# EAGLE schematic Adafruit PowerBoost 1000C Rev B (EAGLE 9.2.2)
COMPANY: ADAFRUIT INDUSTRIES; DRAWN: KTOWN; REV: A
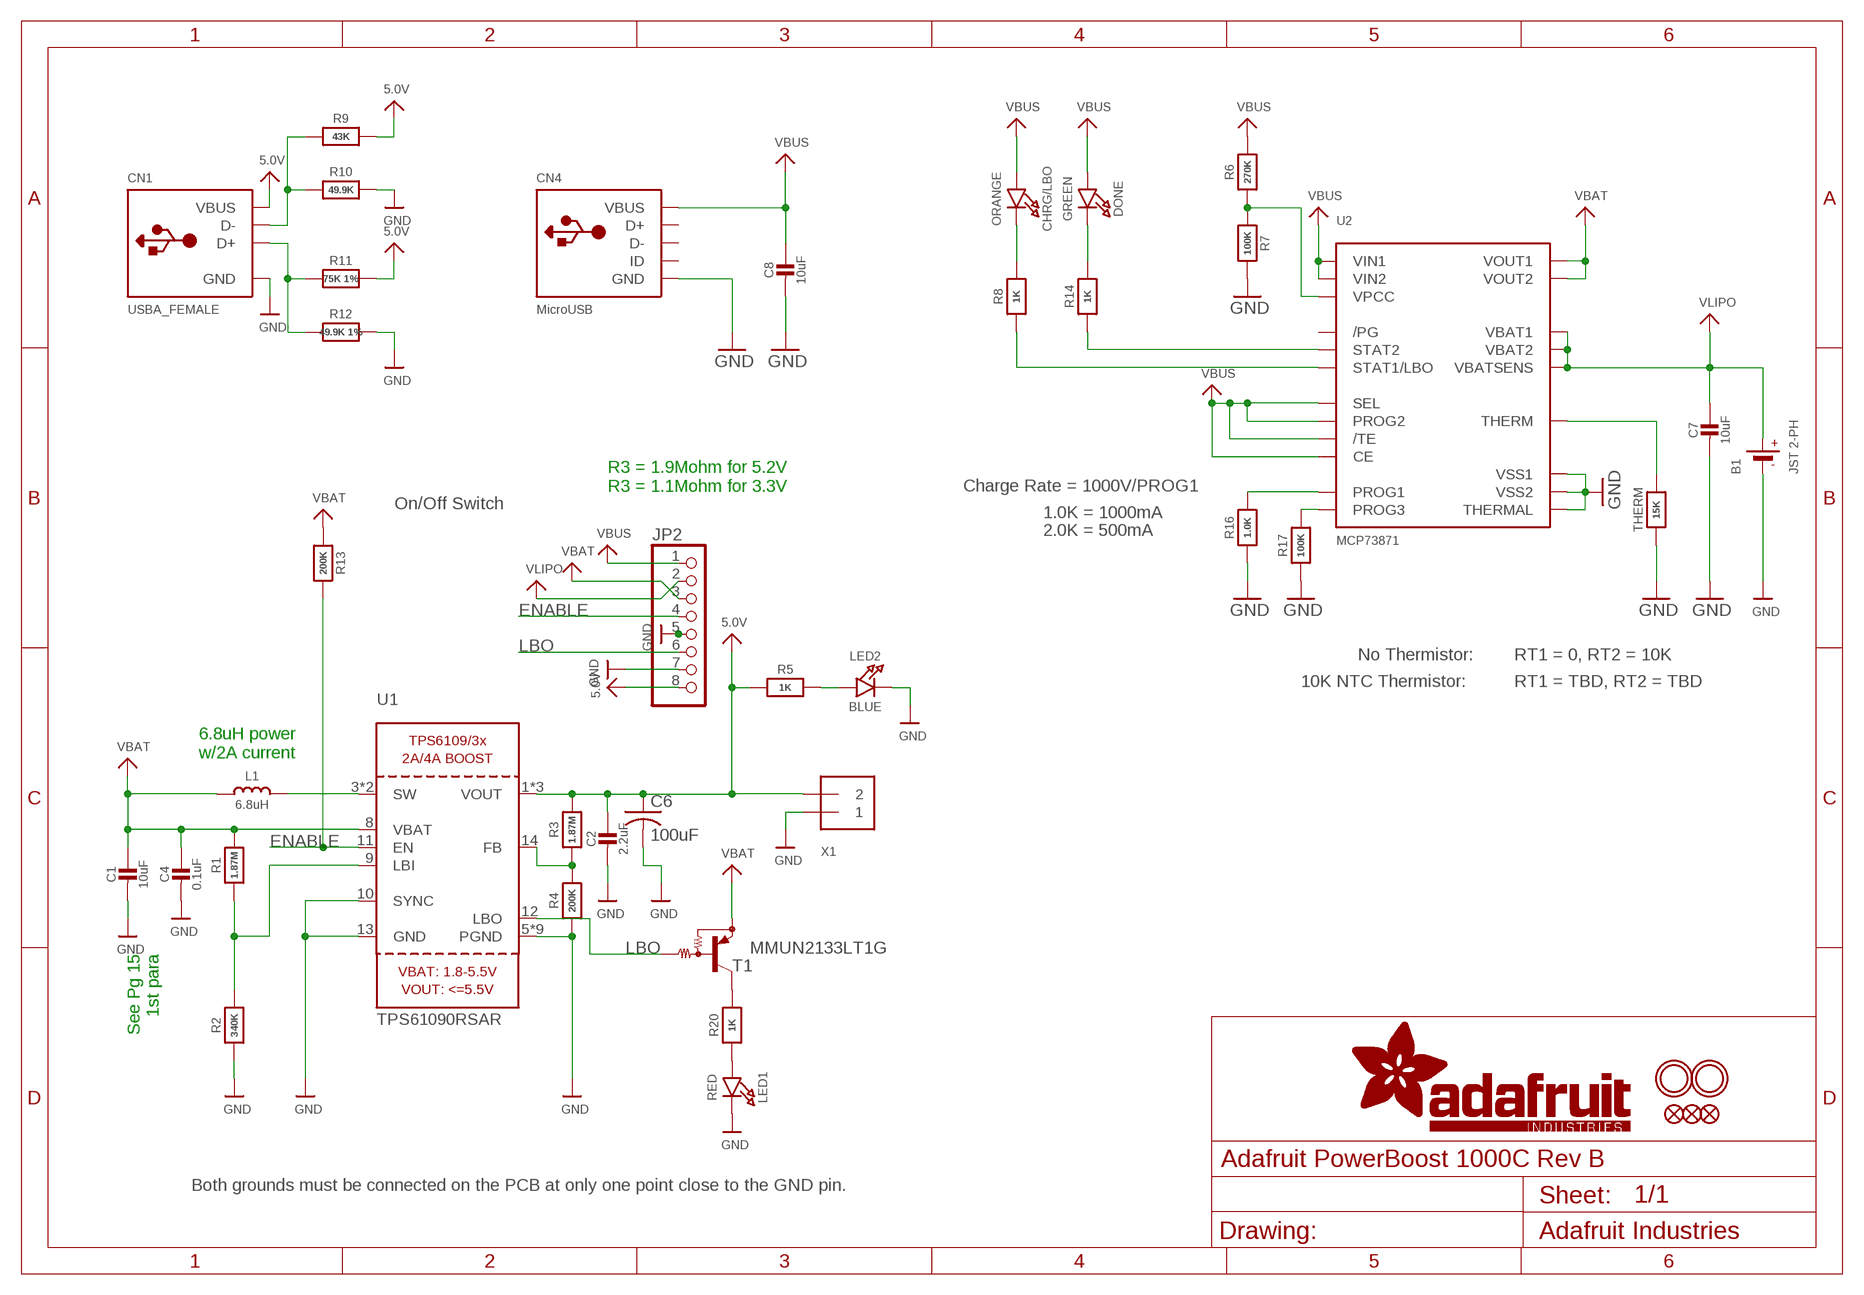
[diagram p0: schematic, sheet 1]

## Parts
B1  JST 2-PH  BATTERY  [JSTPH2]
C1  10uF  CAP_CERAMIC0805-NOOUTLINE  [0805-NO]
C2  2.2uF  CAP_CERAMIC0805-NOOUTLINE  [0805-NO]
C4  0.1uF  CAP_CERAMIC0805_10MGAP  [0805_10MGAP]
C6  100uF  C-USC1210  [C1210]
C7  10uF  CAP_CERAMIC0805-NOOUTLINE  [0805-NO]
C8  10uF  CAP_CERAMIC0805-NOOUTLINE  [0805-NO]
CHRG/LBO  ORANGE  LED0805_NOOUTLINE  [CHIPLED_0805_NOOUTLINE]
CN1  USBA_FEMALE  USB_TYPEAPTHFML  [USB_HOST-PTH]
CN4  MicroUSB  USBMICRO_20329  [4UCONN_20329]
DONE  GREEN  LED0805_NOOUTLINE  [CHIPLED_0805_NOOUTLINE]
FID1  FIDUCIAL""  [FIDUCIAL_1MM]
FID2  FIDUCIAL""  [FIDUCIAL_1MM]
FID3  FIDUCIAL""  [FIDUCIAL_1MM]
JP2  HEADER-1X8ROUND  [1X08_ROUND]
L1  6.8uH  INDUCTORTDK_VLC5045  [INDUCTOR_5X5MM_TDK_VLC5045]
LED1  RED  LED0805_NOOUTLINE  [CHIPLED_0805_NOOUTLINE]
LED2  BLUE  LED0805_NOOUTLINE  [CHIPLED_0805_NOOUTLINE]
R1  1.87M  RESISTOR_0805MP  [_0805MP]
R2  340K  RESISTOR_0805MP  [_0805MP]
R3  1.87M  RESISTOR0805_NOOUTLINE  [0805-NO]
R4  200K  RESISTOR0805_NOOUTLINE  [0805-NO]
R5  1K  RESISTOR0805_NOOUTLINE  [0805-NO]
R6  270K  RESISTOR0805_NOOUTLINE  [0805-NO]
R7  100K  RESISTOR0805_NOOUTLINE  [0805-NO]
R8  1K  RESISTOR0805_NOOUTLINE  [0805-NO]
R9  43K  RESISTOR0805_NOOUTLINE  [0805-NO]
R10  49.9K  RESISTOR0805_NOOUTLINE  [0805-NO]
R11  75K 1%  RESISTOR0805_NOOUTLINE  [0805-NO]
R12  49.9K 1%  RESISTOR0805_NOOUTLINE  [0805-NO]
R13  200K  RESISTOR0805_NOOUTLINE  [0805-NO]
R14  1K  RESISTOR0805_NOOUTLINE  [0805-NO]
R16  1.0K  RESISTOR0805_NOOUTLINE  [0805-NO]
R17  100K  RESISTOR0805_NOOUTLINE  [0805-NO]
R20  1K  RESISTOR0805_NOOUTLINE  [0805-NO]
T1  MMUN2133LT1G  MUN2114T1-PNP_DRIVER-SC59-BEC  [SC59-BEC]
THERM  15K  RESISTOR0805_NOOUTLINE  [0805-NO]
U1  TPS61090RSAR  VREG_TPS6103X  [PVQFN-16]
U2  MCP73871  [QFN20_4MM]
U$10  MOUNTINGHOLE2.5  [MOUNTINGHOLE_2.5_PLATED]
U$11  MOUNTINGHOLE2.5  [MOUNTINGHOLE_2.5_PLATED]
X1  TERMBLOCK_1X2  [TERMBLOCK_1X2-3.5MM]

## Nets
5.0V: C2.1 C6.1 CN1.VBUS JP2.8 R3.2 R5.1 R9.2 R11.2 U1.1(VOUT) U1.15(VOUT) U1.16(VOUT) X1.2
D+: CN1.D+ R11.1 R12.1
D-: CN1.D- R9.1 R10.1
ENABLE: JP2.4 R13.2 U1.11(EN)
GND: B1.1(-) C1.2 C2.2 C4.2 C6.2 C7.2 C8.2 CN1.GND CN4.BASE@1(GND) CN4.BASE@2(GND) CN4.GND CN4.SPRT@1(GND) CN4.SPRT@2(GND) CN4.SPRT@3(GND) CN4.SPRT@4(GND) JP2.5 JP2.7 LED1.C LED2.C R2.1 R4.1 R7.2 R10.2 R12.2 R16.1 R17.1 THERM.1 U1.5(PGND) U1.6(PGND) U1.7(PGND) U1.10(SYNC) U1.13(GND) U1.P$18(PGND) U1.P$19(PGND) U1.P$20(PGND) U1.P$21(PGND) U1.P$22(PGND) U1.THERMAL(PGND) U2.P$10(VSS1) U2.P$11(VSS2) U2.P$21(THERMAL) X1.1
LBO: JP2.6 T1.B U1.12(LBO)
N$1: L1.P$2 U1.3(SW) U1.4(SW)
N$2: LED1.A R20.1
N$3: R1.1 R2.2 U1.9(LBI)
N$4: LED2.A R5.2
N$5: R3.1 R4.2 U1.14(FB)
N$6: R20.2 T1.C
N$7: R6.1 R7.1 U2.P$2(VPCC)
N$8: DONE.C R14.2
N$9: R14.1 U2.P$7(STAT2)
N$10: THERM.2 U2.P$5(THERM)
N$11: R8.1 U2.P$8(STAT1/LBO)
N$12: CHRG/LBO.C R8.2
N$13: R17.2 U2.P$12(PROG3)
N$16: R16.2 U2.P$13(PROG1)
VBAT: C1.1 C4.1 JP2.3 L1.P$1 R1.2 R13.1 T1.E U1.8(VBAT) U2.P$1(VOUT1) U2.P$20(VOUT2)
VBUS: C8.1 CHRG/LBO.A CN4.VBUS DONE.A JP2.1 R6.2 U2.P$3(SEL) U2.P$4(PROG2) U2.P$9(/TE) U2.P$17(CE) U2.P$18(VIN1) U2.P$19(VIN2)
VLIPO: B1.2(+) C7.1 JP2.2 U2.P$14(VBAT1) U2.P$15(VBAT2) U2.P$16(VBATSENS)
Unconnected: CN4.D+ CN4.D- CN4.ID U2.P$6(/PG)

## Notes on the sheet
- R3 = 1.9Mohm for 5.2V
  R3 = 1.1Mohm for 3.3V
- Charge Rate = 1000V/PROG1
- On/Off Switch
- 1.0K = 1000mA
- 2.0K = 500mA
- No Thermistor: | RT1 = 0, RT2 = 10K
- 10K NTC Thermistor: | RT1 = TBD, RT2 = TBD
- 6.8uH power
  w/2A current
- See Pg 15
  1st para
- Both grounds must be connected on the PCB at only one point close to the GND pin.

## Library data of the parts
B1 = microbuilder:BATTERY: CR1220 SMT - Digikey: 3001K-ND CD2032 BAT-HLD-001 - Digikey: BAT-HLD-001-ND
C1 C2 C4 C7 C8 = microbuilder:CAP_CERAMIC: Ceramic Capacitors For new designs, use the packages preceded by an '_' character since they are more reliable: The following footprints should be used on most boards: _0402 - Standard footprint for regular board layouts _0603 - Standard footprint for regular board layouts _0805 - Standard footprint for regular board layouts _1206 - Standard footprint for regular board layouts For extremely tight-pitch boards where space is at a premium, the following 'micro-pitch' footprints can be used (smaller pads, no silkscreen outline, etc.): _0402MP - Micro-pitch footprint for very dense/compact boards _0603MP - Micro-pitch footprint for very dense/compact boards _0805MP - Micro-pitch footprint for very dense/compact boards _1206MP - Micro-pitch footprint for very dense/compact boards
C6 = rcl:C-US: CAPACITOR, American symbol
CHRG/LBO DONE LED1 LED2 = microbuilder:LED: LED 0603 - 0603 Surface Mount Package 2mA: Green LED - Low Power (3.9mcd, 2ma, 1.7Vf) - Digikey: 475-2709-2-ND Orange LED - Low Power (9.8mcd, 2ma, 1.8Vf) - Digikey: 475-1194-2-ND Red LED - Low Power (5mcd, 2ma, 1.8Vf) - Digikey: 475-1195-2-ND Yellow LED - Low Power (7mcd, 2ma, 1.8Vf) - Digikey: 475-1196-2-ND 5mA: Blue LED - Low Power (17mcd, 5ma, 2.9Vf) - Digikey: LNJ937W8CRACT-ND 0805 - 0805 Surface Mount Package 2mA: Red LED (8.8mcd, 2mA, 1.8Vf, Clear) - Low Power [Digikey: 475-2510-1-ND] Green LED (5mcd, 2mA, 1.8Vf, Clear) - Low Power [Digikey: 475-2730-1-ND] Yellow LED (11.3mcd, 2mA, 1.8Vf, Clear) - Low Power [Digikey: 475-2555-1-ND] 20mA: Red LED (104mcd, 20mA, Diffused) - LS R976 [Digikey: 475-1278-6-ND] Red LED (12mcd, 20mA, 2.0Vf, Clear) - APT2012EC [Digikey: 754-1128-1-ND] Green LED (15mcd, 20mA, 2.2Vf, Clear) - APT2012GC [Digikey: 754-1131-1-ND] Orange LED (160mcd, 20mA, 2.1Vf, Clear) - APT2012SECK [Digikey: 754-1130-1-ND] 1206 - 1206 Surface Mount Package Green LED (26mcd, 20mA, Diffused) - LG N971 [Digikey: 475-1407-6-ND] Red LED (15mcd, 20mA, Diffused) - LH N974 [Digikey: 475-1416-6-ND] Cree - Cree High-Power Surface Mount LEDs XPEBWT-L1-0000-00D50 - White 111lm 350mA 2.9Vf 6200K 110° XTEAWT-00-0000-00000LEE3 - White 114lm 350mA 2.85Vf 5000K 115° Everlight - Everlight 45-21 Series Surface Mount LEDs 45-21/QK2C-B2832AC2CB2/2T - Warm White 2000mcd 20mA 3.25Vf 3050K 120° 45-21/LK2C-B38452C4CB2/2T - Nuetral White 2000mcd 20mA 3.25Vf 4150K 120° 45-21/LK2C-B50634C6CB2/2T - Cold White 2200mcd 20mA 3.25Vf 5650K 120° PLCC2 Reverse Mount LS T77K-J1L2-1-0-2-R18-Z - Red 11.25mcd 2mA 1.8Vf 630nm 120° LO T77K-L1M2-24-Z - Orange 19.6mcd 2mA 1.8Vf 606nm 120° LY T77K-K2M1-26-Z - Yellow 15.7mcd 2mA 1.8Vf 587nm 120°
CN1 = microbuilder:USB_TYPEA: USB - Type A Connectors Male types stick out and are inserted into a PC or matching females parts (these are the connectors used on USB Memory Sticks, etc.). Female parts are generally used for USB Host and accept a male-type connector. SMT - 4UCON: 10017 PTHFML - Digikey: 609-1045-ND, 4UCon: 05241 PCB - Use 2.0mm thick PCBs with this footprint
CN4 = microbuilder:USB: USB Connectors USBMINIB - Surface Mount Female Mini-B USB Connector 4UConnector: 06564
FID1-FID3 = microbuilder:FIDUCIAL: Fiducial Alignment Points Various fiducial points for machine vision alignment.; BOM: EXCLUDE
JP2 = microbuilder:HEADER-1X8: PIN HEADER
L1 = microbuilder:INDUCTOR: Inductors 0603: 10nH Ceramic Inductor - microwire antenna/RF (Digikey: 712-1434-2-ND) 0805: 560nH Ceramic Inductor - RF (Digikey: 553-1047-1-ND) 270nH Ceramic Inductor - Q = 40@250MHz, +-5%, 1 Ohm DC Resistance (Digikey: 535-10506-2-ND) 1007 (2518 Metric) SMT: 10µH 10% 250mOhm 820mA 1007 Inductor (Digikey: 587-2189-1-ND) 22µH 10% 500mOhm 580mA 1007 Inductor (Digikey: 587-2190-1-ND) 47µH 10% 950mOhm 420mA 1007 Inductor (Digikey: 587-2191-1-ND) 47µH 5% 100mOhm 1A 1008 Inductor (Digikey: 732-1816-1-ND) 5.0x5.0mm (Taiyo Yuden NR5040 Series) 6.8µH 20% 2.3A 64mOhm Inductor (Digikey: 587-2374-2-ND) 5.0x5.0mm (TDK VLC5045 Series) 4.7µH 20% 3.3A 34mOhm Inductor (Digikey: 445-6526-1-ND) 6.8µH 20% 2.7A 46mOhm Inductor (Digikey: 445-6527-1-ND) 6.0x6.0mm (TDK VLC6045 Series) 4.7µH 20% 3.8A 27mOhm Inductor (Digikey: 445-6538-2-ND) 6.8µH 20% 3A 41mOhm Inductor (Digikey: 445-6540-1-ND) 6.2µH 30% 2.2A 45mOhm Inductor (Digikey: SRR5028-6R2YCT-ND) - Not TDK VLC6045 but footprint should match 6.0x6.0mm (TDK SLF6045 Series) 6.8uH 30% 2A 33mOhm Inductor (Digikey: 445-4572-1-ND, Mouser: 810-SLF645T6R8N2R0PF) 6.0x6.0mm (Sumida CDRH5D28 Series) 6.2uH 30% 1.8A 45mOhm Inductor (Digikey: 308-1542-1-ND) Taiyo Yuden NR3015T2R2M - 2.2uH 20% 1.5A (Digikey: 587-1648-2-ND, Mouser: 963-NR3015T2R2M) - Used with TI TPS62172 CoilCraft RFID Transponder Coil - MA5532-AE (For use with AS3935 Lightning Sensor) Vishay IHLP 1.0uH Molded Inductor - 24mOhm DCR, 5A, +/-20%, -55°C-125°C (Digikey: 541-1319-1-ND)
R1-R14 R16 R17 R20 THERM = microbuilder:RESISTOR: Resistors For new designs, use the packages preceded by an '_' character since they are more reliable: The following footprints should be used on most boards: _0402 - Standard footprint for regular board layouts _0603 - Standard footprint for regular board layouts _0805 - Standard footprint for regular board layouts _1206 - Standard footprint for regular board layouts For extremely tight-pitch boards where space is at a premium, the following 'micro-pitch' footprints can be used (smaller pads, no silkscreen outline, etc.): _0402MP - Micro-pitch footprint for very dense/compact boards _0603MP - Micro-pitch footprint for very dense/compact boards _0805MP - Micro-pitch footprint for very dense/compact boards _1206MP - Micro-pitch footprint for very dense/compact boards
T1 = transistor:*-PNP_DRIVER-: PNP Bias Resistor Transistor
U1 = microbuilder:VREG_TPS6103X: TPS6103x 4A Boost - 1.8-5.5V Input, Adjustable Output to 5.5V
U2 = microbuilder:MCP73871: MCP73871 Lithium Polymer Battery Charger Digikey: MCP73871-2CCI/ML-ND
U$10 U$11 = microbuilder:MOUNTINGHOLE: Mounting Hole For #2 screws (0.086"/2.18mm width, 0.094"/2.4mm hole) use 2.5mm; BOM: EXCLUDE
X1 = microbuilder:TERMBLOCK_1X2: 3.5mm Terminal block http://www.ladyada.net/library/pcb/eaglelibrary.html